# Altium schematic sheet CuC_PSU.SchDoc: CuC PSU
size A4; Author: eldar6776@hotmail.com; DrawnBy: Eldar Dedić; Organization: PROVEN d.o.o.; Address1: Adema Buće 102; Address2: 71000 Sarajevo; Address3: Federacija BiH; Address4: Bosna i Hercegovina; DocumentNumber: DE211213; Revision: 001; SheetNumber: 1; SheetTotal: 15; ProjectName: MIKSER SIROVINE
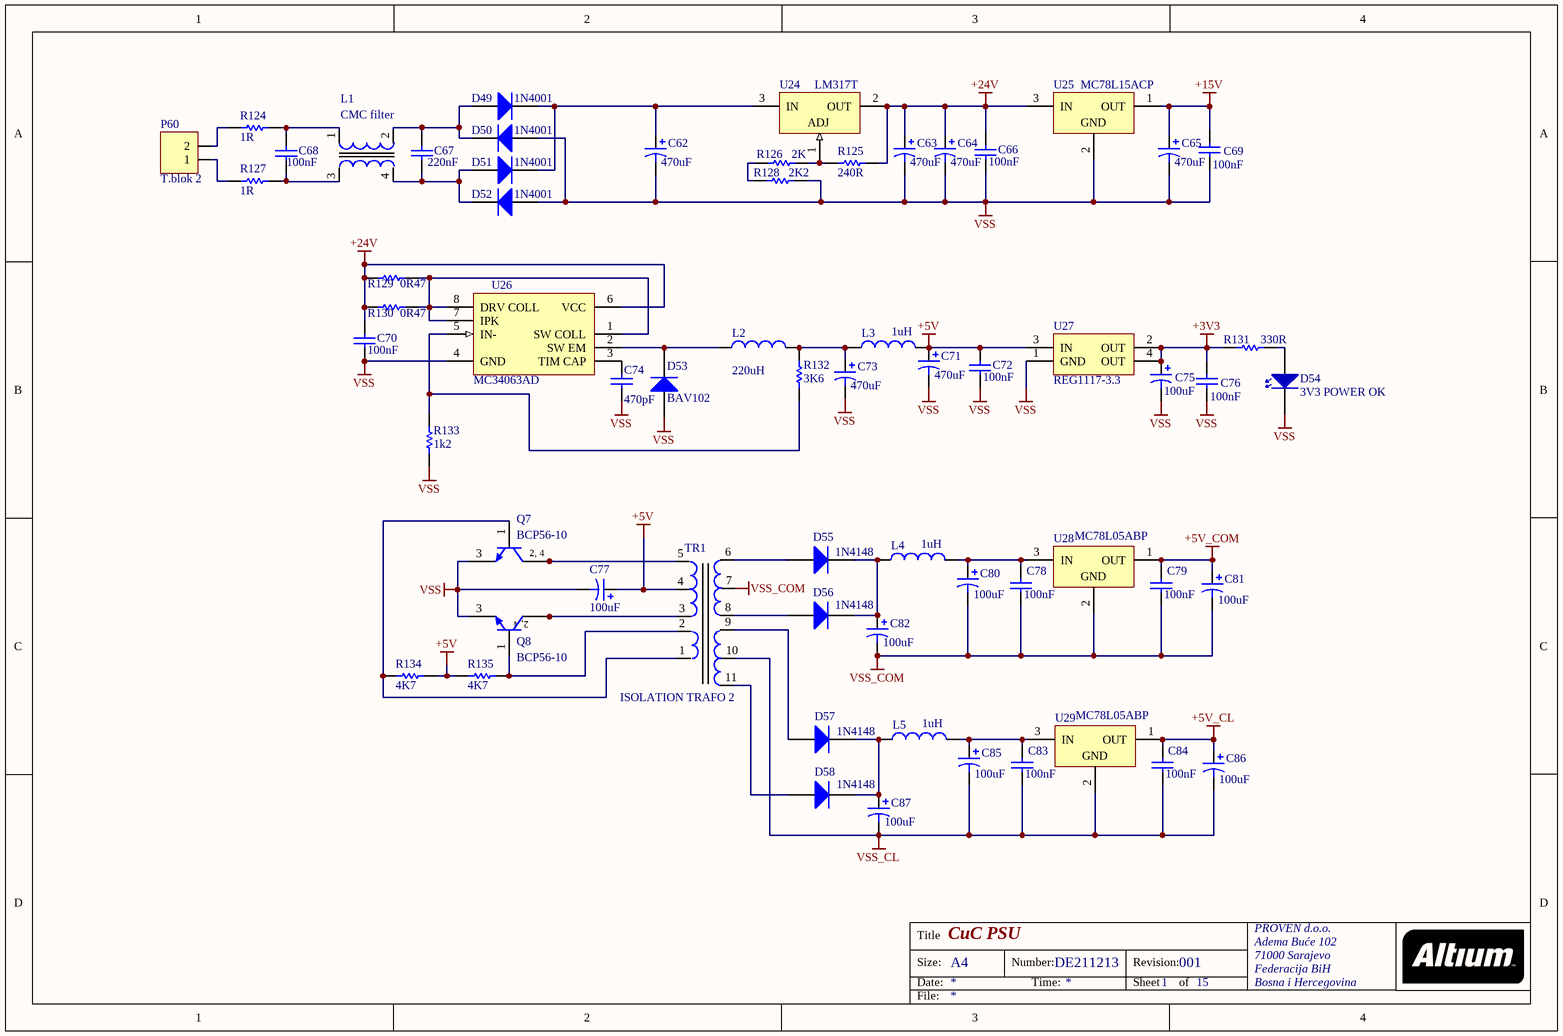
[diagram p0: CuC_PSU.SchDoc]

## Parts
C62  470uF  [CAPPR5-10X16]
C63  470uF  [CAPPR5-10X16]
C64  470uF  [CAPPR5-10X16]
C65  470uF  [CAPPR5-10X16]
C66  value 100nF  [1206]
C67  220nF  [VP60-3.6]
C68  100nF  [VP60-3.6]
C69  value 100nF  [1206]
C70  value 100nF  [1206]
C71  470uF  [CAPPR5-10X16]
C72  value 100nF  [1206]
C73  470uF  [CAPPR5-10X16]
C74  value 470pF  [0805]
C75  100uF  [CAPPR2-5X11]
C76  value 100nF  [1206]
C77  100uF  [CAPPR2-5X11]
C78  value 100nF  [1206]
C79  value 100nF  [1206]
C80  100uF  [CAPPR2-5X11]
C81  100uF  [CAPPR2-5X11]
C82  100uF  [CAPPR2-5X11]
C83  value 100nF  [1206]
C84  value 100nF  [1206]
C85  100uF  [CAPPR2-5X11]
C86  100uF  [CAPPR2-5X11]
C87  100uF  [CAPPR2-5X11]
D49  1N4001  [DO-41]
D50  1N4001  [DO-41]
D51  1N4001  [DO-41]
D52  1N4001  [DO-41]
D53  BAV102  [SOD80C]
D54  3V3 POWER OK  [LED 3mm]
D55  1N4148  [DO-35]
D56  1N4148  [DO-35]
D57  1N4148  [DO-35]
D58  1N4148  [DO-35]
L1  CMC filter  [MREZNI FILTER]
L2  value 220uH  [RB5-10.5]
L3  value 1uH  [RB5-10.5]
L4  value 1uH  [RB5-10.5]
L5  value 1uH  [RB5-10.5]
P60  T.blok 2  [TERMINAL BLOK 2]
Q7  BCP56-10  [SOT223_N]
Q8  BCP56-10  [SOT223_N]
R124  1R  [R6.35x2.3]
R125  240R  [ERA-0805]
R126  2K  [ERA-0805]
R127  1R  [R6.35x2.3]
R128  2K2  [ERA-0805]
R129  0R47  [RD6.35x2.3]
R130  0R47  [RD6.35x2.3]
R131  330R  [ERA-0603]
R132  3K6  [ERA-0805]
R133  1k2  [ERA-0805]
R134  4K7  [ERA-0805]
R135  4K7  [ERA-0805]
TR1  ISOLATION TRAFO 2  [ISOLATION TRAFO 2]
U24  LM317T  [221A-04]
U25  MC78L15ACP  [29-04]
U26  MC34063AD  [626-05]
U27  REG1117-3.3  [ZZ311]
U28  MC78L05ABP  [29-04]
U29  MC78L05ABP  [29-04]

## Nets
+3V3: C75.1 C76.2 R131.1 U27.2(OUT) U27.4(OUT)
+5V: C71.1 C72.2 C77.1 L3.2 R134.1 R135.2 TR1.4 U27.3(IN)
+5V_CL: C84.2 C86.1 U29.1(OUT)
+5V_COM: C79.2 C81.1 U28.1(OUT)
+15V: C65.1 C69.2 U25.1(OUT)
+24V: C63.1 C64.1 C66.2 C70.2 R125.1 R129.1 R130.1 U24.2(OUT) U25.3(IN) U26.6(VCC)
VSS: C62.2 C63.2 C64.2 C65.2 C66.1 C69.1 C70.1 C71.2 C72.1 C73.2 C74.1 C75.2 C76.1 C77.2 D50.1(A) D52.1(A) D53.1(A) D54.1 Q7.3(E) Q8.3(E) R128.1 R133.1 U25.2(GND) U26.4(GND) U27.1(GND)
VSS_CL: C83.1 C84.1 C85.2 C86.2 C87.2 TR1.10 U29.2(GND)
VSS_COM: C78.1 C79.1 C80.2 C81.2 C82.2 TR1.7 U28.2(GND)
NetC62_1: C62.1 D49.2(K) D51.2(K) U24.3(IN)
NetC67_1: C67.1 D51.1(A) D52.2(K) L1.4
NetC67_2: C67.2 D49.1(A) D50.2(K) L1.2
NetC68_1: C68.1 L1.3 R127.1
NetC68_2: C68.2 L1.1 R124.1
NetC73_1: C73.1 L2.2 L3.1 R132.2
NetC74_2: C74.2 U26.3(TIM_CAP)
NetC78_2: C78.2 C80.1 L4.2 U28.3(IN)
NetC82_1: C82.1 D55.2(K) D56.2(K) L4.1
NetC83_2: C83.2 C85.1 L5.2 U29.3(IN)
NetC87_1: C87.1 D57.2(K) D58.2(K) L5.1
NetD53_2: D53.2(K) L2.1 U26.2(SW_EM)
NetD54_2: D54.2 R131.2
NetD55_1: D55.1(A) TR1.6
NetD56_1: D56.1(A) TR1.8
NetD57_1: D57.1(A) TR1.9
NetD58_1: D58.1(A) TR1.11
NetP60_1: P60.1 R127.2
NetP60_2: P60.2 R124.2
NetQ7_1: Q7.1(B) R134.2 TR1.1
NetQ7_2: Q7.2(C) Q7.4(C) TR1.5
NetQ8_1: Q8.1(B) R135.1 TR1.2
NetQ8_2: Q8.2(C) Q8.4(C) TR1.3
NetR125_2: R125.2 R126.2 U24.1(ADJ)
NetR126_1: R126.1 R128.2
NetR129_2: R129.2 R130.2 U26.1(SW_COLL) U26.7(IPK) U26.8(DRV_COLL)
NetR132_1: R132.1 R133.2 U26.5(IN-)

## Notes on the sheet
- Title
- Size:
- Date:
- A4
- Number:
- Time:
- Revision:
- Sheet
- of
- File:
- (in symbol BCP56-10) 2, 4

## Library data of the parts
C62-C65 C71 C73 = EKA00DD347F00: Aluminum Electrolytic Capacitor, Radial Style with Long Leads: 470uF, 35V; Note: Refer to Manufacturer's Data Sheets for other lead formations; DrillSize: Nominal, Rounded To The Nearest 0.1mm; Published: 19-Mar-2004; DatasheetDocument: 20-Feb-2001; PackageReference: CAPPR5-10X16; Publisher: Altium Limited; ComponentLink1Description: Manufacturer Link; ComponentLink1URL: http://www.vishay.com/; ComponentLink2Description: Datasheet; ComponentLink2URL: http://www.vishay.com/docs/25014/eka.pdf; Value: 470uF
C66 C69 C70 C72 C76 C78 C79 C83 C84 = C1206: Ceramic Chip Capacitor - Standard; Published: 17-Jul-2002; LatestRevisionDate: 19-Mar-2004; LatestRevisionNote: Silkscreen size reduced.; DatasheetDocument: Mar-2001; PackageDocument: Mar-2001; PackageReference: 1206; Publisher: Altium Limited; Code_JEITA: 1206; Code_IPC: 3216 [1206]; ComponentLink1Description: Manufacturer Link; ComponentLink1URL: http://www.kemet.com/; ComponentLink2Description: Datasheet; ComponentLink2URL: http://www.kemet.com/kemet/web/homepage/kechome.nsf/vapubfilesname/F3102TA.pdf/$file/F3102TA.pdf
C67 C68 = VP60BA683KA: Dipped Radial Multilayer Ceramic Capacitor COG (NPO): 68nF, 50/63V; Published: 17-Dec-2003; LatestRevisionDate: 19-Mar-2004; LatestRevisionNote: PCB Footprint - Drill hole diameter reduced.; DatasheetDocument: 2-Jan-2002; PackageDocument: 2-Jan-2002; PackageReference: VP60-3.6; Publisher: Altium Limited; ComponentLink1Description: Manufacturer Link; ComponentLink1URL: http://www.vishay.com/; Value: 68nF
C74 = C0805: Ceramic Chip Capacitor - Standard; Note: Footprint corresponds to dimensions for bulk cassette packaging. This case size has tightened tolerances.; Published: 17-Jul-2002; LatestRevisionDate: 19-Mar-2004; LatestRevisionNote: Silkscreen size reduced.; DatasheetDocument: Mar-2001; PackageDocument: Mar-2001; PackageReference: 0805; Publisher: Altium Limited; Code_JEITA: 0805; Code_IPC: 2012[0805]; ComponentLink1Description: Manufacturer Link; ComponentLink1URL: http://www.kemet.com/; ComponentLink2Description: Datasheet; ComponentLink2URL: http://www.kemet.com/kemet/web/homepage/kechome.nsf/vapubfilesname/F3102TA.pdf/$file/F3102TA.pdf
C75 C77 C80-C82 C85-C87 = EKA00AA310D00: Aluminum Electrolytic Capacitor, Radial Style with Long Leads: 100uF, 16V; Note: Refer to Manufacturer's Data Sheets for other lead formations; DrillSize: Nominal, Rounded To The Nearest 0.1mm; Published: 19-Mar-2004; DatasheetDocument: 20-Feb-2001; PackageReference: CAPPR2-5X11; Publisher: Altium Limited; ComponentLink1Description: Manufacturer Link; ComponentLink1URL: http://www.vishay.com/; ComponentLink2Description: Datasheet; ComponentLink2URL: http://www.vishay.com/docs/25014/eka.pdf; Value: 100uF
D49-D52 = Diode 1N4007: 1 Amp General Purpose Rectifier; Published: 8-Jun-2000; LatestRevisionDate: 17-Jul-2002; LatestRevisionNote: Re-released for DXP Platform.; DatasheetVersion: 1998; PackageVersion: Aug-1999; PackageReference: DO-41; Publisher: Altium Limited; PackageDescription: Diode, Axial; Body 5.2 x 2.7 mm (LxDia. max), Lead Dia. 0.86 mm (max); Code_JEDEC: DO-204-AL; ComponentLink1Description: Manufacturer Link; ComponentLink1URL: http://www.fairchildsemi.com/; ComponentLink2Description: Datasheet; ComponentLink2URL: http://www.fairchildsemi.com/ds/1N%2F1N4001.pdf
D53 = BAV102: General-purpose Diode; Published: 17-Sep-2003; LatestRevisionDate: 19-Mar-2004; LatestRevisionNote: Silkscreen size reduced.; DatasheetVersion: 17-Sep-1996; PackageVersion: Jan-2002; PackageReference: SOD80C; Publisher: Altium Limited; PackageDescription: Metal Electrode Face (MELF) Diode; Body 3.5 x 1.6 mm (LxDia); ComponentLink1Description: Manufacturer Link; ComponentLink1URL: http://www.semiconductors.philips.com/; ComponentLink2Description: Datasheet; ComponentLink2URL: http://www.semiconductors.philips.com/acrobat/datasheets/BAV100_2.pdf
D54 = LED 3mm
D55-D58 = Diode 1N4148: High Conductance Fast Diode; Published: 8-Jun-2000; LatestRevisionDate: 17-Jul-2002; LatestRevisionNote: Re-released for DXP Platform.; DatasheetVersion: 1997; PackageReference: DO-35; Publisher: Altium Limited; PackageDescription: Diode, Axial; Body 3.8 x 1.9 mm (LxDia. max), Lead Dia. 0.53 mm (max); Code_JEDEC: DO-204-AH; ComponentLink1Description: Manufacturer Link; ComponentLink1URL: http://www.fairchildsemi.com/; ComponentLink2Description: Datasheet; ComponentLink2URL: http://www.fairchildsemi.com/ds/1N%2F1N4148.pdf
L1 = MREZNI FILTER
L2-L5 = PCMC063T-R82MN: SMT Power Choke Coil; Size 7.3×6.6×3.0mm, ±20% Tolerance, 0.82uH, 13A; PCB_Layout: Complies with manufacturer's recommendation.; Published: 26-Sep-2008; DatasheetVersion: Oct-2007; PackageVersion: Oct-2007; PackageReference: PCMC063T; Publisher: Altium Limited; PackageDescription: SM Power Choke Coil; 2 Leads; Body 7.3 x 6.6 x 3.0 mm (LxWxH); ComponentLink1Description: Manufacturer Link; ComponentLink1URL: http://www.susumu.co.jp/; ComponentLink2Description: Datasheet; ComponentLink2URL: http://www.susumu.co.jp/english/pdf/products-j07-01.pdf
P60 = TERMINAL BLOK 2: Terminal blok konektor 3,5 mm
Q7 Q8 = BCP56-10: NPN Medium Power Transistor; Published: 17-Sep-2003; LatestRevisionDate: 12-Dec-2006; LatestRevisionNote: IPC-7351 Footprint Added.; DatasheetVersion: 10-Oct-2001; PackageVersion: Aug-2001; PackageReference: SOT223; Publisher: Altium Limited; PackageDescription: 4-Pin SOT-223 Package 2.3 mm Pitch, 7 mm Lead Span; ComponentLink1Description: Manufacturer Link; ComponentLink1URL: http://www.semiconductors.philips.com/; ComponentLink2Description: Datasheet; ComponentLink2URL: http://www.semiconductors.philips.com/acrobat/datasheets/BC639_BCP56_BCX56_7.pdf
R124 R127 = ERG12: Metal Oxide Film Resistor, 0.1 Ohm to 47k Ohm Range, 2% and 5% Tolerance, 0.5 W; Published: 17-Dec-2003; PackageReference: R6.35x2.3; Publisher: Altium Limited; ComponentLink1Description: Manufacturer Link; ComponentLink1URL: http://www.panasonic.com/industrial/components/resistive_products.htm; ComponentLink2Description: Datasheet; ComponentLink2URL: http://www.panasonic.com/industrial/components/pdf/AOA0000CE18.pdf
R125 R126 R128 R132-R135 = ERAS: Metal Film Thermosensitive Chip Resistor, 0.56 Ohm to 10k Ohm Range, 5% Tolerance, 0805 Size, 0.1 W; Note: If flow soldering, adjust pad width of PCB Footprint to 0.7 - 0.8 times the width of the resistor.; Published: 17-Dec-2003; LatestRevisionDate: 19-Mar-2004; LatestRevisionNote: Silkscreen size reduced.; PackageDocument: Mar-2003; PackageReference: ERA-0805; Publisher: Altium Limited; Code_IPC: 2012 [0805]; ComponentLink1Description: Manufacturer Link; ComponentLink1URL: http://www.panasonic.com/industrial/components/resistive_products.htm; ComponentLink2Description: Datasheet; ComponentLink2URL: http://www.panasonic.com/industrial/components/pdf/AOF0000CE1.pdf
R129 R130 = ERDS1T: Carbon Film Resistor, 1 Ohm to 3.3M Ohm Range, 5% Tolerance, 0.5 W; Published: 17-Dec-2003; PackageReference: RD6.35x2.3; Publisher: Altium Limited; ComponentLink1Description: Manufacturer Link; ComponentLink1URL: http://www.panasonic.com/industrial/components/resistive_products.htm; ComponentLink2Description: Datasheet; ComponentLink2URL: http://www.panasonic.com/industrial/components/pdf/AOA0000CE12.pdf
R131 = ERA3Y: Rectangular Thick Film Chip Resistor, 10 Ohm to 330k Ohm Range, 0.1% and 0.5% Tolerance, 0603 Size, 0.063 W; Note: If flow soldering, adjust pad width of PCB Footprint to 0.7 - 0.8 times the width of the resistor.; Published: 17-Dec-2003; LatestRevisionDate: 19-Mar-2004; LatestRevisionNote: Silkscreen size reduced.; PackageDocument: Mar-2003; PackageReference: ERA-0603; Publisher: Altium Limited; Code_IPC: 1608 [0603]; ComponentLink1Description: Manufacturer Link; ComponentLink1URL: http://www.panasonic.com/industrial/components/resistive_products.htm; ComponentLink2Description: Datasheet; ComponentLink2URL: http://www.panasonic.com/industrial/components/pdf/AOA0000CE8.pdf
U24 = LM317T: 3-Terminal Adjustable Positive Voltage Regulator; Note: Heatsink surface connected to pin 2.; Published: 17-Jul-2002; DatasheetVersion: 1988; PackageReference: 221A-04; Publisher: Altium Limited; PackageDescription: TO, Thru-Hole, Vertical, Heatsink Mounted; 3 In-Line Leads; Pitch 2.54 mm; Code_JEDEC: TO-262-AA; ComponentLink1Description: Manufacturer Link; ComponentLink1URL: http://www.onsemi.com/site/products/taxonomy/0,4438,503,00.html; ComponentLink2Description: Datasheet; ComponentLink2URL: http://www.onsemi.com/pub/Collateral/LM317-D.PDF
U25 = MC78L15ACP: 3-Terminal Low-Current Positive Fixed Voltage Regulator; Published: 17-Jul-2002; DatasheetVersion: 1988; PackageVersion: 1996; PackageReference: 29-04; Publisher: Altium Limited; PackageDescription: TO, Flat Index; 3 In-Line, Axial Leads; Body Dia. 4.8mm; Leads 0.48 x 0.5 mm (max); ComponentLink1Description: Manufacturer Link; ComponentLink1URL: http://www.onsemi.com/site/products/taxonomy/0,4438,503,00.html; ComponentLink2Description: Datasheet; ComponentLink2URL: http://www.onsemi.com/pub/Collateral/MC78L00A-D.PDF
U26 = MC34063AD: DC-to-DC Converter Control Circuit; Published: 15-Apr-2002; LatestRevisionDate: 13-Apr-2006; LatestRevisionNote: IPC-7351 Footprint Added.; DatasheetVersion: 1996; PackageVersion: 1998; PackageReference: 751-05; Publisher: Altium Limited; PackageDescription: 8-Pin Small Outline Integrated Circuit 1.27 mm Pitch; Code_JEDEC: MS-012-AA; Code_IPC: SOIC127P600-8; ComponentLink1Description: Manufacturer Link; ComponentLink1URL: http://www.onsemi.com/site/products/taxonomy/0,4438,503,00.html; ComponentLink2Description: Datasheet; ComponentLink2URL: http://www.onsemi.com/pub/Collateral/MC34063A-D.PDF
U27 = REG1117-3.3: 800mA and 1A Low Dropout Positive Regulator 2.85V, 3.3V, 5V, and Adjustable; Published: 8-Jun-2000; LatestRevisionDate: 17-Jul-2002; LatestRevisionNote: Re-released for DXP Platform.; DatasheetVersion: Sep-1997; PackageVersion: revC; PackageReference: ZZ311; Publisher: Altium Limited; PackageDescription: SOT-223/SC-73; 4 Leads; Body 6.7 x 7.3 mm, inc. leads (LxW max); ComponentLink1Description: Manufacturer Link; ComponentLink1URL: http://www.ti.com/; ComponentLink2Description: Datasheet; ComponentLink2URL: http://www-s.ti.com/sc/ds/REG1117.pdf
U28 U29 = MC78L05ABP: 3-Terminal Low-Current Positive Fixed Voltage Regulator; Published: 17-Jul-2002; DatasheetVersion: 1988; PackageVersion: 1996; PackageReference: 29-04; Publisher: Altium Limited; PackageDescription: TO, Flat Index; 3 In-Line, Axial Leads; Body Dia. 4.8mm; Leads 0.48 x 0.5 mm (max); ComponentLink1Description: Manufacturer Link; ComponentLink1URL: http://www.onsemi.com/site/products/taxonomy/0,4438,503,00.html; ComponentLink2Description: Datasheet; ComponentLink2URL: http://www.onsemi.com/pub/Collateral/MC78L00A-D.PDF